# EAGLE schematic Modul PCB_lama (EAGLE 9.6.2)
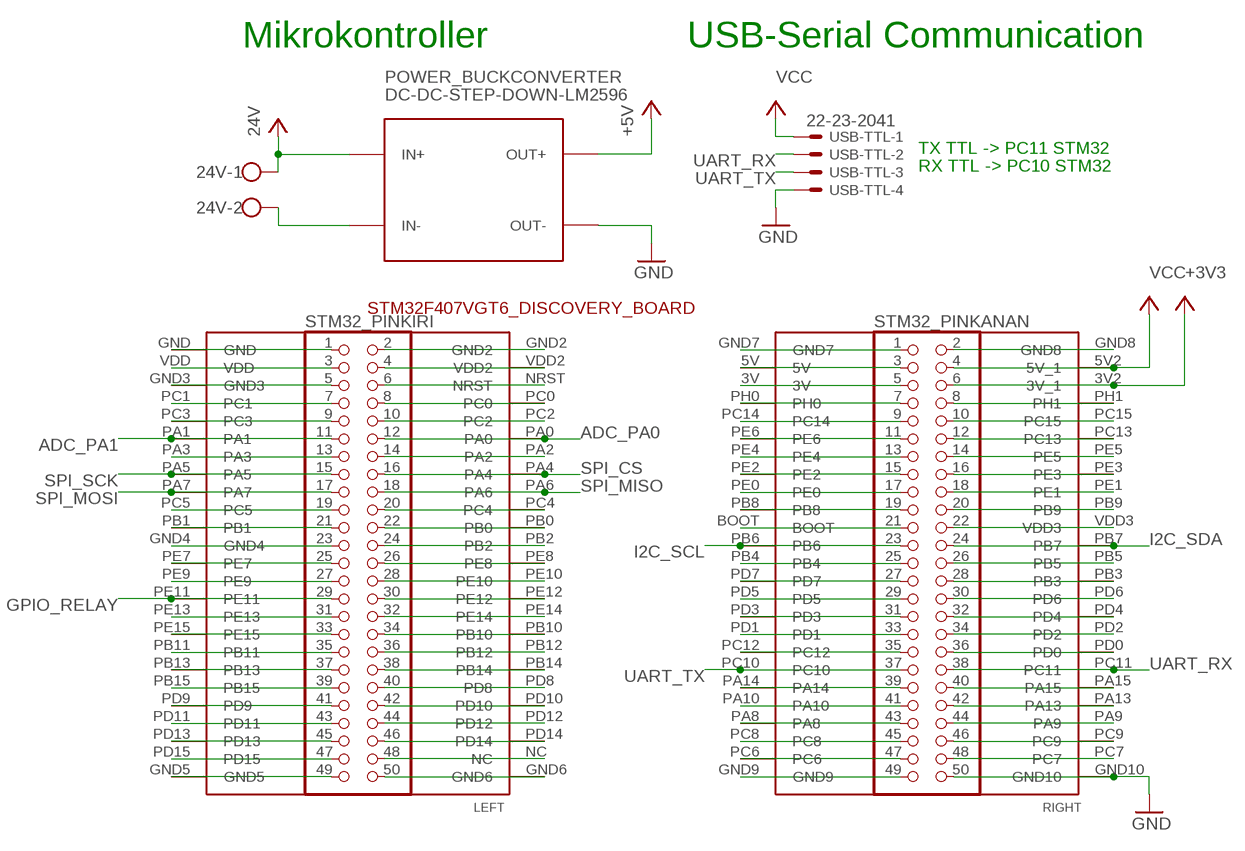
[diagram p0: schematic, sheet 1, part 1 of 2]
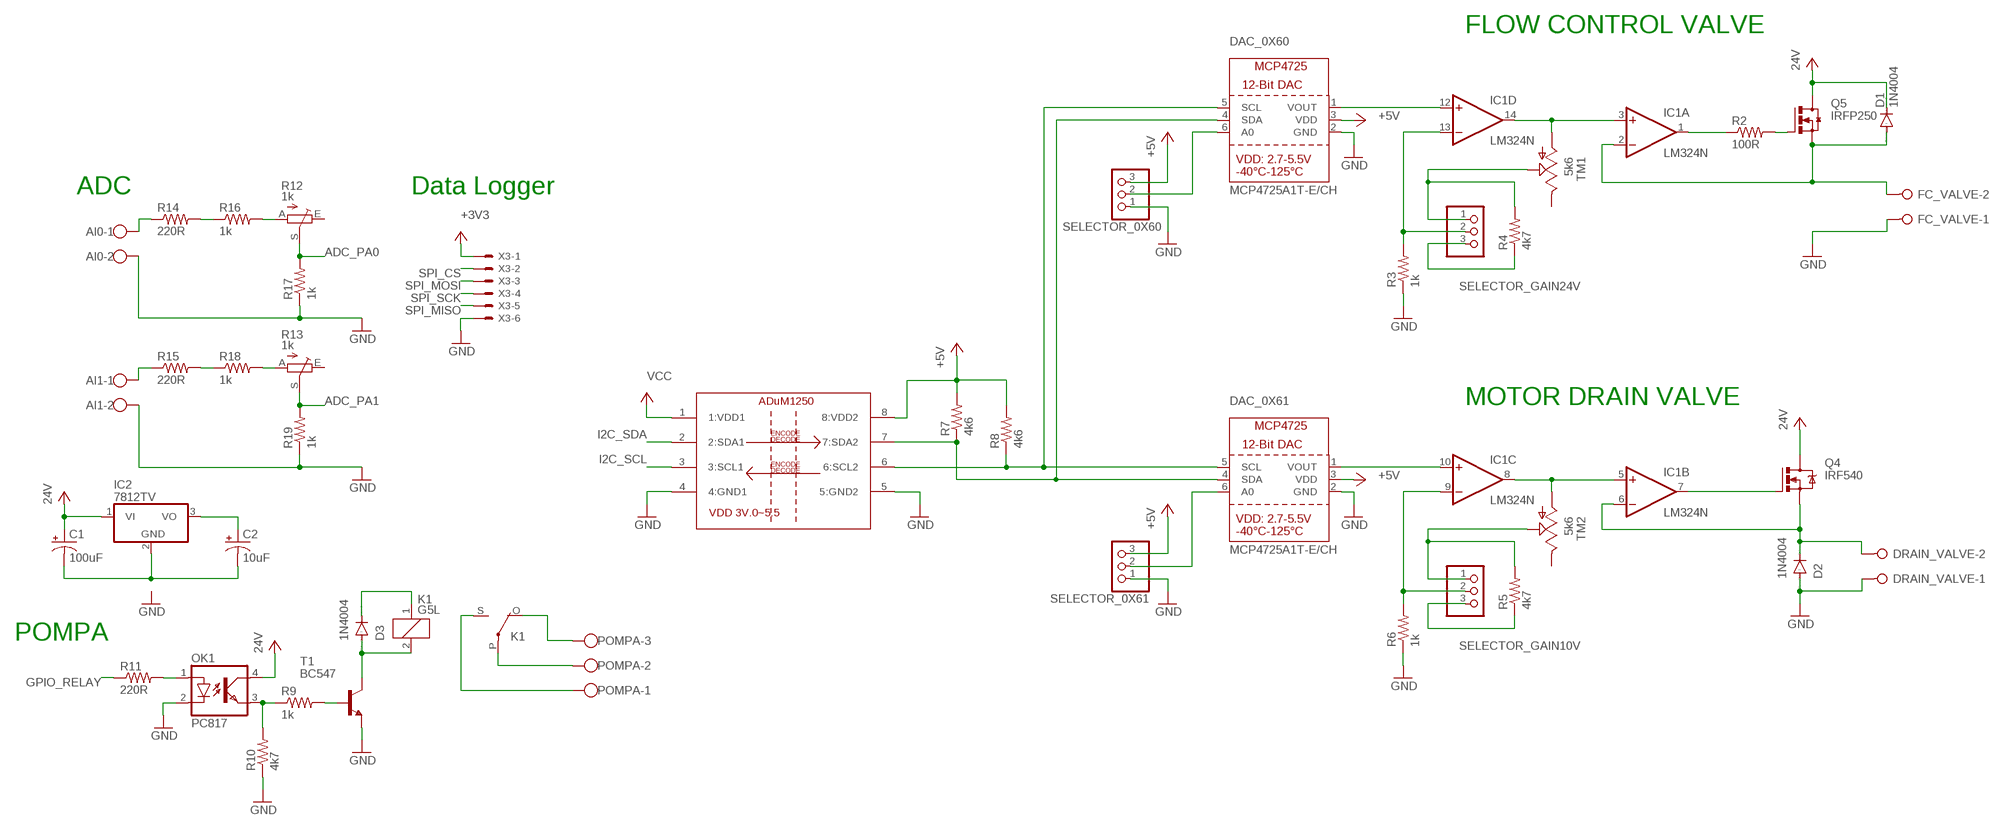
[diagram p1: schematic, sheet 1, part 2 of 2]

## Parts
24V  W237-102  [W237-102]
AI0  W237-102  [W237-102]
AI1  W237-102  [W237-102]
C1  100uF  CPOL-USE2.5-6  [E2,5-6]
C2  10uF  CPOL-USE2.5-6  [E2,5-6]
D1  1N4004  [DO41-10]
D2  1N4004  [DO41-10]
D3  1N4004  [DO41-10]
DAC_0X60  MCP4725A1T-E/CH  DAC_MCP4725  [SOT23-6]
DAC_0X61  MCP4725A1T-E/CH  DAC_MCP4725  [SOT23-6]
DRAIN_VALVE  W237-02P  [W237-132]
FC_VALVE  W237-02P  [W237-132]
IC1  LM324N  [DIL14]
IC2  7812TV  [TO220V]
K1  G5L  [G5LE]
OK1  PC817  [DIL04]
POMPA  W237-103  [W237-103]
POWER_BUCKCONVERTER  DC-DC-STEP-DOWN-LM2596  [DC-DC-STEP-DOWN-LM2596]
Q4  IRF540  [TO220BV]
Q5  IRFP250  [TO-247AD-V]
R2  100R  R-US_0207/10  [0207/10]
R3  1k  R-US_0207/10  [0207/10]
R4  4k7  R-US_0207/10  [0207/10]
R5  4k7  R-US_0207/10  [0207/10]
R6  1k  R-US_0207/10  [0207/10]
R7  4k6  R-US_0207/10  [0207/10]
R8  4k6  R-US_0207/10  [0207/10]
R9  1k  R-US_0207/10  [0207/10]
R10  4k7  R-US_0207/10  [0207/10]
R11  220R  R-US_0207/10  [0207/10]
R12  1k  TRIM_EU-RJ9W  [RJ9W]
R13  1k  TRIM_EU-RJ9W  [RJ9W]
R14  220R  R-US_0207/10  [0207/10]
R15  220R  R-US_0207/10  [0207/10]
R16  1k  R-US_0207/10  [0207/10]
R17  1k  R-US_0207/10  [0207/10]
R18  1k  R-US_0207/10  [0207/10]
R19  1k  R-US_0207/10  [0207/10]
SELECTOR_0X60  PINHD-1X3  [1X03]
SELECTOR_0X61  PINHD-1X3  [1X03]
SELECTOR_GAIN10V  PINHD-1X3  [1X03]
SELECTOR_GAIN24V  PINHD-1X3  [1X03]
STM32_PINKANAN  PINHD-2X25  [2X25]
STM32_PINKIRI  PINHD-2X25  [2X25]
STM32F407VGT6_DISCOVERY_BOARD  STM32F4-DISCOVERY  [STM32F407VG]
T1  BC547  [TO92]
TM1  5k6  TRIM  [6MM]
TM2  5k6  TRIM  [6MM]
U$1  ADUM1250  [SOIC_N]
USB-TTL  22-23-2041  [22-23-2041]
X3  22-23-2061  [22-23-2061]

## Nets
+3V3: STM32_PINKANAN.6 STM32F407VGT6_DISCOVERY_BOARD.3V2(3V_1) X3.1
+5V: DAC_0X60.3(VDD) DAC_0X61.3(VDD) POWER_BUCKCONVERTER.OUT+ R7.2 R8.2 SELECTOR_0X60.3 SELECTOR_0X61.3 U$1.8(8:VDD2)
ADC_PA0: R12.S R17.2 STM32_PINKIRI.12 STM32F407VGT6_DISCOVERY_BOARD.PA0
ADC_PA1: R13.S R19.2 STM32_PINKIRI.11 STM32F407VGT6_DISCOVERY_BOARD.PA1
GND: AI0.2 AI1.2 D2.A DAC_0X60.2(GND) DAC_0X61.2(GND) DRAIN_VALVE.1 FC_VALVE.1 OK1.2(C) POWER_BUCKCONVERTER.OUT- R3.1 R6.1 R10.1 R17.1 R19.1 SELECTOR_0X60.1 SELECTOR_0X61.1 STM32_PINKANAN.50 STM32F407VGT6_DISCOVERY_BOARD.GND10 T1.1(E) U$1.4(4:GND1) U$1.5(5:GND2) USB-TTL.4 X3.6
GPIO_RELAY: R11.1 STM32_PINKIRI.29 STM32F407VGT6_DISCOVERY_BOARD.PE11
I2C_SCL: STM32_PINKANAN.23 STM32F407VGT6_DISCOVERY_BOARD.PB6 U$1.3(3:SCL1)
I2C_SDA: STM32_PINKANAN.24 STM32F407VGT6_DISCOVERY_BOARD.PB7 U$1.2(2:SDA1)
N$1: IC1.1(A:OUT) R2.1
N$2: D2.C DRAIN_VALVE.2 IC1.6(B:-IN) Q4.S
N$3: IC1.7(B:OUT) Q4.G
N$4: Q5.G R2.2
N$5: IC1.3(A:+IN) IC1.14(D:OUT) TM1.A
N$6: IC1.5(B:+IN) IC1.8(C:OUT) TM2.A
N$7: D1.A FC_VALVE.2 IC1.2(A:-IN) Q5.S
N$8: IC1.13(D:-IN) R3.2 SELECTOR_GAIN24V.2
N$9: R4.1 SELECTOR_GAIN24V.3
N$10: R4.2 SELECTOR_GAIN24V.1 TM1.S
N$11: R5.2 SELECTOR_GAIN10V.1 TM2.S
N$12: IC1.9(C:-IN) R6.2 SELECTOR_GAIN10V.2
N$13: R5.1 SELECTOR_GAIN10V.3
N$14: DAC_0X60.1(VOUT) IC1.12(D:+IN)
N$15: DAC_0X61.1(VOUT) IC1.10(C:+IN)
N$16: R9.2 T1.2(B)
N$17: 24V.2 POWER_BUCKCONVERTER.IN-
N$18: DAC_0X60.6(A0) SELECTOR_0X60.2
N$19: DAC_0X60.4(SDA) DAC_0X61.4(SDA) R7.1 U$1.7(7:SDA2)
N$20: DAC_0X60.5(SCL) DAC_0X61.5(SCL) R8.1 U$1.6(6:SCL2)
N$21: D3.A K1.2 T1.3(C)
N$22: DAC_0X61.6(A0) SELECTOR_0X61.2
N$23: OK1.3(EMIT) R9.1 R10.2
N$24: K1.P(2:P) POMPA.2
N$25: K1.S(2:S) POMPA.1
N$26: K1.O(2:O) POMPA.3
N$27: OK1.1(A) R11.2
N$28: AI0.1 R14.1
N$29: R14.2 R16.1
N$30: R12.A R16.2
N$31: D3.C K1.1
N$32: AI1.1 R15.1
N$33: STM32_PINKIRI.1 STM32F407VGT6_DISCOVERY_BOARD.GND
N$34: R15.2 R18.1
N$35: R13.A R18.2
N$36: C2.+ IC2.3(VO)
N$37: C1.- C2.- IC2.2(GND)
N$38: STM32_PINKIRI.3 STM32F407VGT6_DISCOVERY_BOARD.VDD
N$39: STM32_PINKIRI.5 STM32F407VGT6_DISCOVERY_BOARD.GND3
N$40: STM32_PINKIRI.7 STM32F407VGT6_DISCOVERY_BOARD.PC1
N$41: STM32_PINKIRI.9 STM32F407VGT6_DISCOVERY_BOARD.PC3
N$42: STM32_PINKIRI.13 STM32F407VGT6_DISCOVERY_BOARD.PA3
N$43: STM32_PINKIRI.19 STM32F407VGT6_DISCOVERY_BOARD.PC5
N$44: STM32_PINKIRI.21 STM32F407VGT6_DISCOVERY_BOARD.PB1
N$45: STM32_PINKIRI.23 STM32F407VGT6_DISCOVERY_BOARD.GND4
N$46: STM32_PINKIRI.25 STM32F407VGT6_DISCOVERY_BOARD.PE7
N$47: STM32_PINKIRI.27 STM32F407VGT6_DISCOVERY_BOARD.PE9
N$48: STM32_PINKIRI.31 STM32F407VGT6_DISCOVERY_BOARD.PE13
N$49: STM32_PINKIRI.33 STM32F407VGT6_DISCOVERY_BOARD.PE15
N$50: STM32_PINKIRI.35 STM32F407VGT6_DISCOVERY_BOARD.PB11
N$51: STM32_PINKIRI.37 STM32F407VGT6_DISCOVERY_BOARD.PB13
N$52: STM32_PINKIRI.39 STM32F407VGT6_DISCOVERY_BOARD.PB15
N$53: STM32_PINKIRI.41 STM32F407VGT6_DISCOVERY_BOARD.PD9
N$54: STM32_PINKIRI.43 STM32F407VGT6_DISCOVERY_BOARD.PD11
N$55: STM32_PINKIRI.45 STM32F407VGT6_DISCOVERY_BOARD.PD13
N$56: STM32_PINKIRI.47 STM32F407VGT6_DISCOVERY_BOARD.PD15
N$57: STM32_PINKIRI.49 STM32F407VGT6_DISCOVERY_BOARD.GND5
N$58: STM32_PINKIRI.50 STM32F407VGT6_DISCOVERY_BOARD.GND6
N$59: STM32_PINKIRI.48 STM32F407VGT6_DISCOVERY_BOARD.NC
N$60: STM32_PINKIRI.46 STM32F407VGT6_DISCOVERY_BOARD.PD14
N$61: STM32_PINKIRI.44 STM32F407VGT6_DISCOVERY_BOARD.PD12
N$62: STM32_PINKIRI.42 STM32F407VGT6_DISCOVERY_BOARD.PD10
N$63: STM32_PINKIRI.40 STM32F407VGT6_DISCOVERY_BOARD.PD8
N$64: STM32_PINKIRI.38 STM32F407VGT6_DISCOVERY_BOARD.PB14
N$65: STM32_PINKIRI.36 STM32F407VGT6_DISCOVERY_BOARD.PB12
N$66: STM32_PINKIRI.34 STM32F407VGT6_DISCOVERY_BOARD.PB10
N$67: STM32_PINKIRI.32 STM32F407VGT6_DISCOVERY_BOARD.PE14
N$68: STM32_PINKIRI.30 STM32F407VGT6_DISCOVERY_BOARD.PE12
N$69: STM32_PINKIRI.28 STM32F407VGT6_DISCOVERY_BOARD.PE10
N$70: STM32_PINKIRI.26 STM32F407VGT6_DISCOVERY_BOARD.PE8
N$71: STM32_PINKIRI.24 STM32F407VGT6_DISCOVERY_BOARD.PB2
N$72: STM32_PINKIRI.22 STM32F407VGT6_DISCOVERY_BOARD.PB0
N$73: STM32_PINKIRI.2 STM32F407VGT6_DISCOVERY_BOARD.GND2
N$74: STM32_PINKIRI.4 STM32F407VGT6_DISCOVERY_BOARD.VDD2
N$75: STM32_PINKIRI.6 STM32F407VGT6_DISCOVERY_BOARD.NRST
N$76: STM32_PINKIRI.8 STM32F407VGT6_DISCOVERY_BOARD.PC0
N$77: STM32_PINKIRI.10 STM32F407VGT6_DISCOVERY_BOARD.PC2
N$78: STM32_PINKIRI.14 STM32F407VGT6_DISCOVERY_BOARD.PA2
N$79: STM32_PINKIRI.20 STM32F407VGT6_DISCOVERY_BOARD.PC4
N$80: STM32_PINKANAN.1 STM32F407VGT6_DISCOVERY_BOARD.GND7
N$81: STM32_PINKANAN.3 STM32F407VGT6_DISCOVERY_BOARD.5V
N$82: STM32_PINKANAN.5 STM32F407VGT6_DISCOVERY_BOARD.3V
N$83: STM32_PINKANAN.7 STM32F407VGT6_DISCOVERY_BOARD.PH0
N$84: STM32_PINKANAN.9 STM32F407VGT6_DISCOVERY_BOARD.PC14
N$85: STM32_PINKANAN.11 STM32F407VGT6_DISCOVERY_BOARD.PE6
N$86: STM32_PINKANAN.13 STM32F407VGT6_DISCOVERY_BOARD.PE4
N$87: STM32_PINKANAN.15 STM32F407VGT6_DISCOVERY_BOARD.PE2
N$88: STM32_PINKANAN.17 STM32F407VGT6_DISCOVERY_BOARD.PE0
N$89: STM32_PINKANAN.19 STM32F407VGT6_DISCOVERY_BOARD.PB8
N$90: STM32_PINKANAN.21 STM32F407VGT6_DISCOVERY_BOARD.BOOT
N$91: STM32_PINKANAN.25 STM32F407VGT6_DISCOVERY_BOARD.PB4
N$92: STM32_PINKANAN.27 STM32F407VGT6_DISCOVERY_BOARD.PD7
N$93: STM32_PINKANAN.29 STM32F407VGT6_DISCOVERY_BOARD.PD5
N$94: STM32_PINKANAN.31 STM32F407VGT6_DISCOVERY_BOARD.PD3
N$95: STM32_PINKANAN.33 STM32F407VGT6_DISCOVERY_BOARD.PD1
N$96: STM32_PINKANAN.35 STM32F407VGT6_DISCOVERY_BOARD.PC12
N$97: STM32_PINKANAN.39 STM32F407VGT6_DISCOVERY_BOARD.PA14
N$98: STM32_PINKANAN.41 STM32F407VGT6_DISCOVERY_BOARD.PA10
N$99: STM32_PINKANAN.43 STM32F407VGT6_DISCOVERY_BOARD.PA8
N$100: STM32_PINKANAN.45 STM32F407VGT6_DISCOVERY_BOARD.PC8
N$101: STM32_PINKANAN.47 STM32F407VGT6_DISCOVERY_BOARD.PC6
N$102: STM32_PINKANAN.49 STM32F407VGT6_DISCOVERY_BOARD.GND9
N$103: STM32_PINKANAN.48 STM32F407VGT6_DISCOVERY_BOARD.PC7
N$104: STM32_PINKANAN.46 STM32F407VGT6_DISCOVERY_BOARD.PC9
N$105: STM32_PINKANAN.44 STM32F407VGT6_DISCOVERY_BOARD.PA9
N$106: STM32_PINKANAN.42 STM32F407VGT6_DISCOVERY_BOARD.PA13
N$107: STM32_PINKANAN.40 STM32F407VGT6_DISCOVERY_BOARD.PA15
N$108: STM32_PINKANAN.36 STM32F407VGT6_DISCOVERY_BOARD.PD0
N$109: STM32_PINKANAN.34 STM32F407VGT6_DISCOVERY_BOARD.PD2
N$110: STM32_PINKANAN.32 STM32F407VGT6_DISCOVERY_BOARD.PD4
N$111: STM32_PINKANAN.30 STM32F407VGT6_DISCOVERY_BOARD.PD6
N$112: STM32_PINKANAN.28 STM32F407VGT6_DISCOVERY_BOARD.PB3
N$113: STM32_PINKANAN.26 STM32F407VGT6_DISCOVERY_BOARD.PB5
N$114: STM32_PINKANAN.22 STM32F407VGT6_DISCOVERY_BOARD.VDD3
N$115: STM32_PINKANAN.20 STM32F407VGT6_DISCOVERY_BOARD.PB9
N$116: STM32_PINKANAN.2 STM32F407VGT6_DISCOVERY_BOARD.GND8
N$117: STM32_PINKANAN.8 STM32F407VGT6_DISCOVERY_BOARD.PH1
N$118: STM32_PINKANAN.10 STM32F407VGT6_DISCOVERY_BOARD.PC15
N$119: STM32_PINKANAN.12 STM32F407VGT6_DISCOVERY_BOARD.PC13
N$120: STM32_PINKANAN.14 STM32F407VGT6_DISCOVERY_BOARD.PE5
N$121: STM32_PINKANAN.16 STM32F407VGT6_DISCOVERY_BOARD.PE3
N$122: STM32_PINKANAN.18 STM32F407VGT6_DISCOVERY_BOARD.PE1
SPI_CS: STM32_PINKIRI.16 STM32F407VGT6_DISCOVERY_BOARD.PA4 X3.2
SPI_MISO: STM32_PINKIRI.18 STM32F407VGT6_DISCOVERY_BOARD.PA6 X3.5
SPI_MOSI: STM32_PINKIRI.17 STM32F407VGT6_DISCOVERY_BOARD.PA7 X3.3
SPI_SCK: STM32_PINKIRI.15 STM32F407VGT6_DISCOVERY_BOARD.PA5 X3.4
UART_RX: STM32_PINKANAN.38 STM32F407VGT6_DISCOVERY_BOARD.PC11 USB-TTL.2
UART_TX: STM32_PINKANAN.37 STM32F407VGT6_DISCOVERY_BOARD.PC10 USB-TTL.3
VCC: 24V.1 C1.+ D1.C IC2.1(VI) OK1.4(COL) POWER_BUCKCONVERTER.IN+ Q4.D Q5.D STM32_PINKANAN.4 STM32F407VGT6_DISCOVERY_BOARD.5V2(5V_1) U$1.1(1:VDD1) USB-TTL.1 ; supply symbol labelled 24V
Unconnected: R12.E R13.E TM1.E TM2.E

## Notes on the sheet
- FLOW CONTROL VALVE
- ADC | Data Logger
- Mikrokontroller | USB-Serial Communication
- TX TTL -> PC11 STM32
- RX TTL -> PC10 STM32
- MOTOR DRAIN VALVE
- POMPA

## Power pins joined to a net without a drawn wire
V+: IC1.4(P:V+)
V-: IC1.11(P:V-)

## Library data of the parts
24V AI0 AI1 = con-wago-500:W237-102: WAGO SCREW CLAMP; MPN: 237-102; OC_FARNELL: unknown; OC_NEWARK: 70K9898
C1 C2 = rcl:CPOL-US: POLARIZED CAPACITOR, American symbol; SPICEPREFIX: C
D1-D3 = diode:1N4004: DIODE general purpose rectifier, 1 A
DAC_0X60 DAC_0X61 = microbuilder:DAC_MCP4725: MCP4725 - 12-Bit I2C DAC with on-board EEPROM Settling Time: 6 µs 2.7-5.5V Supply 100kHz, 400kHz, 3.4 Mbps I²C EEPROM can be used to store a specific output voltage which will be set coming out of reset I²C Address: 1100 A2 A1 A0 A0 is set via the A0 pin, A2 and A1 are hard-wired on the chip depending on the model chosen: Part Number A2 A1 Code MCP4725A0T-E/CH 0 0 AJNN MCP4725A1T-E/CH 0 1 APNN MCP4725A2T-E/CH 1 0 AQNN MCP4725A3T-E/CH 1 1 ARNN
DRAIN_VALVE FC_VALVE = con-wago-508:W237-02P: WAGO SREW CLAMP; OC_FARNELL: unknown; OC_NEWARK: unknown
IC1 = linear:LM324: OP AMP
IC2 = linear:78*: Positive VOLTAGE REGULATOR Source: http://cache.national.com/ds/LM/LM78L05.pdf http://www.fairchildsemi.com/ds/LM/LM7805.pdf
K1 = relay:G5L: RELAY 1 x switch, 10 A/120 V AC, 8 A/30 V ADC, Omron; OC_FARNELL: unknown; OC_NEWARK: unknown
OK1 = optocoupler:PC817: SHARP OPTO COUPLER; MPN: PC817X4J000F; OC_FARNELL: 9707727; OC_NEWARK: 97K7059
POMPA = con-wago-500:W237-103: WAGO SCREW CLAMP; MPN: 237-103; OC_FARNELL: unknown; OC_NEWARK: 18M7116
POWER_BUCKCONVERTER = diy-modules:DC-DC-STEP-DOWN-LM2596: DC/DC Step-Down Regulator based on LM2596-ADJ chip LM2596 datasheet available here: http://www.ti.com/lit/ds/symlink/lm2596.pdf Click here to find device on ebay.com <http://www.ebay.com/sch/lm2596+power+regulator>
Q4 = transistor-power:IRF540: HEXFET Power MOSFET
Q5 = transistor-power:IRFP25*: 33A/27A, 200V/150V, 0.085/0.012 Ohm, N-Channel Power MOSFET Source: Fairchild Semiconductor Corporation
R2-R11 R14-R19 = rcl:R-US_: RESISTOR, American symbol; SPICEPREFIX: R
R12 R13 = pot:TRIM_EU-: POTENTIOMETER
SELECTOR_0X60 SELECTOR_0X61 SELECTOR_GAIN10V SELECTOR_GAIN24V = pinhead:PINHD-1X3: PIN HEADER
STM32_PINKANAN STM32_PINKIRI = pinhead:PINHD-2X25: PIN HEADER
STM32F407VGT6_DISCOVERY_BOARD = STM32F4 DISCOVERY:STM32F4-DISCOVERY: STM32F4DISCOVERY STM32F407VG Create by Jairo Reyes Email: jairo.314@hotmail.com
T1 = transistor:BC547: NPN TRANSISTOR
TM1 TM2 = adafruit:TRIM
U$1 = ADUM1250:ADUM1250
USB-TTL = con-molex:22-23-2041: .100" (2.54mm) Center Header - 4 Pin; MF: MOLEX; MPN: 22-23-2041; OC_FARNELL: 1462920; OC_NEWARK: 38C0355
X3 = con-molex:22-23-2061: .100" (2.54mm) Center Header - 6 Pin; MF: MOLEX; MPN: 22-23-2061; OC_FARNELL: 1462922; OC_NEWARK: 27C1933